# EAGLE schematic KlimacontrollerSchaltplan (EAGLE 9.6.2)
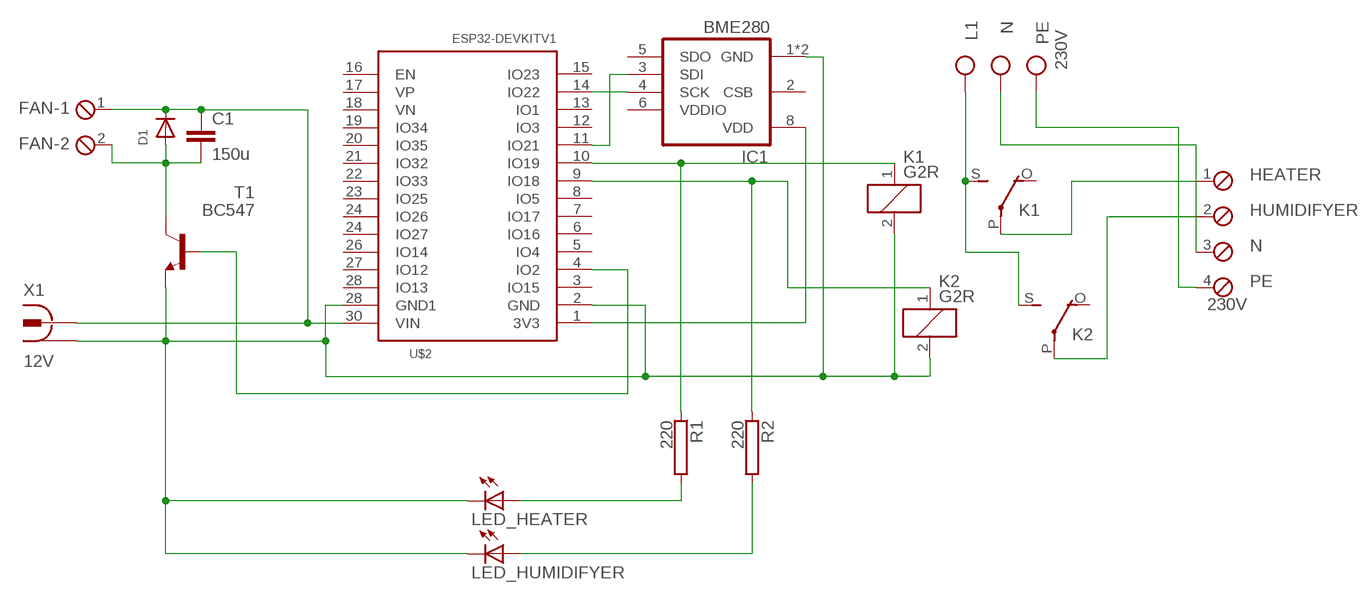
[diagram p0: schematic, sheet 1]

## Parts
C1  150u  C5/2.5  [C5B2.5]
D1  DIODEDO-1N4148  [DO-1N4148]
FAN  MPT2  [2POL254]
IC1  BME280  [BME280]
K1  G2R  [G2R]
K2  G2R  [G2R]
LED_HEATER  LED  [SMARTLED-TTW]
LED_HUMIDIFYER  LED  [SMARTLED-TTW]
R1  220  RAC01  [AC01]
R2  220  RAC01  [AC01]
T1  BC547  [TO92]
U$2  ESP32DEVKITV1  [ESP32-DEVKITV1]
X1  12V  736880-49  [736880-49]
X3  230V  MPT4  [4POL254]
X4  230V  MKDS_5/3-6,35  [MKDS_5/3-635]

## Nets
N$1: IC1.1(GND) IC1.7(GND) K1.2 K2.2 LED_HEATER.C@1(C) LED_HUMIDIFYER.A@1(A) LED_HUMIDIFYER.C@1(C) R2.2 T1.1(E) U$2.2(GND) U$2.28(GND1) X1.1 X1.1@1 X1.1@2
N$3: IC1.4(SCK) U$2.14(IO22)
N$4: K1.1 R1.1 U$2.10(IO19)
N$5: IC1.8(VDD) U$2.1(3V3)
N$6: IC1.3(SDI) U$2.11(IO21)
N$7: K2.1 R2.1 U$2.9(IO18)
N$8: K1.S(2:S) K2.S(2:S) X4.3
N$9: K1.P(2:P) X3.1
N$10: K2.P(2:P) X3.2
N$11: X3.3 X4.2
N$12: X3.4 X4.1
N$13: T1.2(B) U$2.4(IO2)
N$14: C1.1 D1.C FAN.1 U$2.30(VIN) X1.2
N$15: C1.2 D1.A FAN.2 T1.3(C)
N$16: LED_HEATER.A@1(A) R1.2
Unconnected: IC1.2(CSB) IC1.5(SDO) K1.O(2:O) K2.O(2:O) U$2.3(IO15) U$2.5(IO4) U$2.6(IO16) U$2.7(IO17) U$2.8(IO5) U$2.12(IO3) U$2.13(IO1) U$2.15(IO23) U$2.16(EN) U$2.17(VP) U$2.18(VN) U$2.19(IO34) U$2.20(IO35) U$2.21(IO32) U$2.22(IO33) U$2.23(IO25) U$2.24(IO26) U$2.24(IO27) U$2.26(IO14) U$2.27(IO12) U$2.28(IO13)

## Power pins joined to a net without a drawn wire
VDDIO: IC1.6(VDDIO)

## Library data of the parts
C1 = capacitor-wima:C: CAPACITOR naming: grid - package width
D1 = adafruit:DIODE: Diode SMADIODE - SMA Surface Mount Package 20V 1A Schottky Diode Digikey: 641-1014-6-ND DO-1N4148 - Through Hole Small Current Diode SOD-123 20V 1 A (.5mV Vf) Schottky Diode - Digikey: MBRX120TPMSCT-ND SOD-323 10V 570mA (.38mV Vf, 3ns) Schottky Diode - Digikey: ZLLS410CT-ND SOD-523 30V 30mA Schottky Diode (RB751S-40TE61) - Digikey: RB751S-40TE61CT-ND SOT23-R/W - SOT23 Package (R = Solder Paste/Reflow Ovens, W = Hand-Soldering) BAT54Film 40V 300mA - Digikey: 497-7162-1-ND
FAN = con-phoenix-254:MPT2: PHOENIX CONNECTOR; OC_FARNELL: unknown; OC_NEWARK: unknown
IC1 = bosch-bme280:BME280: DIGITAL HUMIDITY, PRESSURE AND TEMPERATURE SENSOR * Digital interface I²C (up to 3.4 MHz) and SPI (3 and 4 wire, up to 10 MHz)* Supply voltage VDD main supply voltage range: 1.71 V to 3.6 V*VDDIO interface voltage range: 1.2 V to 3.6 V Operating range -40…+85 °C, 0…100 % rel. humidity, 300…1100 hPa The library has been designed by Richard Magdycz <https://www.facebook.com/groups/eaglecadsoftUK>
K1 K2 = relay:G2R: RELAY 1 x switch, Omron; OC_FARNELL: 1569185; OC_NEWARK: unknown
LED_HEATER LED_HUMIDIFYER = adafruit:LED: LED OSRAM: - CHIPLED LG R971, LG N971, LY N971, LG Q971, LY Q971, LO R971, LY R971 LH N974, LH R974 LS Q976, LO Q976, LY Q976 LO Q996 - Hyper CHIPLED LW Q18S LB Q993, LB Q99A, LB R99A - SideLED LS A670, LO A670, LY A670, LG A670, LP A670 LB A673, LV A673, LT A673, LW A673 LH A674 LY A675 LS A676, LA A676, LO A676, LY A676, LW A676 LS A679, LY A679, LG A679 - Hyper Micro SIDELED® LS Y876, LA Y876, LO Y876, LY Y876 LT Y87S - SmartLED LW L88C, LW L88S LB L89C, LB L89S, LG L890 LS L89K, LO L89K, LY L89K LS L896, LA L896, LO L896, LY L896 - TOPLED LS T670, LO T670, LY T670, LG T670, LP T670 LSG T670, LSP T670, LSY T670, LOP T670, LYG T670 LG T671, LOG T671, LSG T671 LB T673, LV T673, LT T673, LW T673 LH T674 LS T676, LA T676, LO T676, LY T676, LB T676, LH T676, LSB T676, LW T676 LB T67C, LV T67C, LT T67C, LS T67K, LO T67K, LY T67K, LW E67C LS E67B, LA E67B, LO E67B, LY E67B, LB E67C, LV E67C, LT E67C LW T67C LS T679, LY T679, LG T679 LS T770, LO T770, LY T770, LG T770, LP T770 LB T773, LV T773, LT T773, LW T773 LH T774 LS E675, LA E675, LY E675, LS T675 LS T776, LA T776, LO T776, LY T776, LB T776 LHGB T686 LT T68C, LB T68C - Hyper Mini TOPLED® LB M676 - Mini TOPLED Santana® LG M470 LS M47K, LO M47K, LY M47K Source: http://www.osram.convergy.de/
R1 R2 = resistor-power:R: Power Resitor; OC_FARNELL: unknown; OC_NEWARK: unknown
T1 = transistor:BC547: NPN TRANSISTOR
U$2 = ESP32-DEVKITV1:ESP32DEVKITV1
X1 = con-conrad:736880-49: Cinch Connector ( RCA Jack ) Cinch-Einbaukupplung 90º 72345 Vernickelt BKL Electronic Source: Conrad <http://www.conrad.de/ce/de/product/736880>
X3 = con-phoenix-254:MPT4: PHOENIX CONNECTOR; OC_FARNELL: unknown; OC_NEWARK: unknown
X4 = con-phoenix-mkds_5:MKDS_5/3-: MKDS 5/3-6,35 Source: PHOENIX CONTACT; MF: FARNELL; MPN: 1714968; OC_FARNELL: 3704695; OC_NEWARK: 71C4092